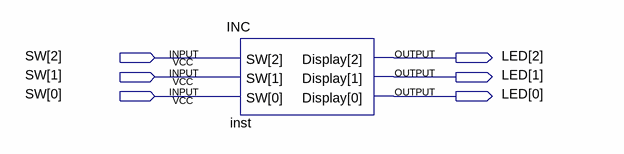
[diagram p0: schematic sheet]
// Quartus schematic PARTED.bdf as structural Verilog: 1 symbols, 6 pins
module PARTED (
  input  [2:0] SW,
  output [2:0] LED
);

  INC inst (.SW(SW), .Display(LED));
endmodule
